# Altium project myAmp.PrjPcb
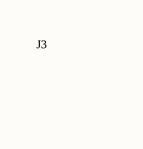
[diagram p0: myAmp.SchDoc, top left]
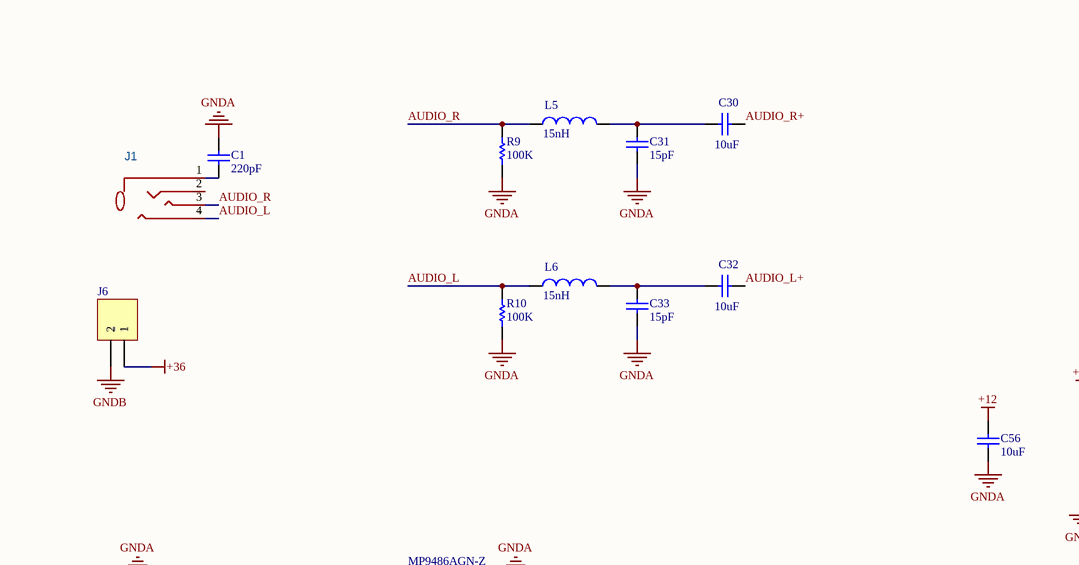
[diagram p1: myAmp.SchDoc, top middle]
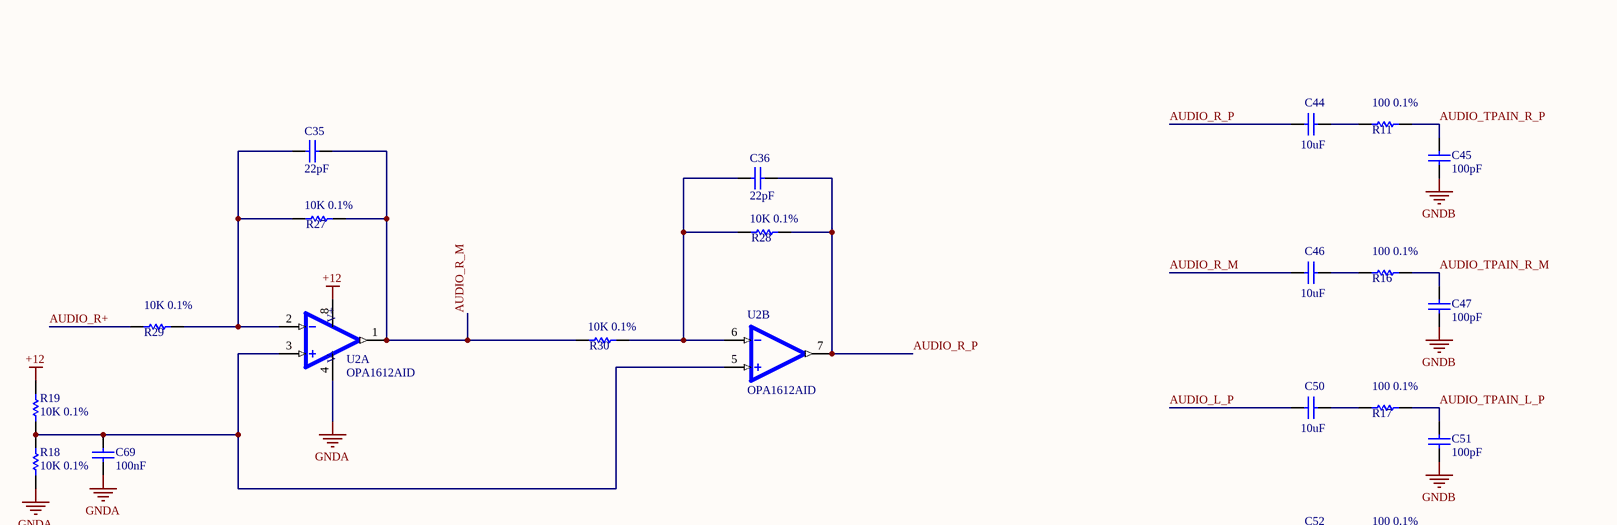
[diagram p2: myAmp.SchDoc, top right]
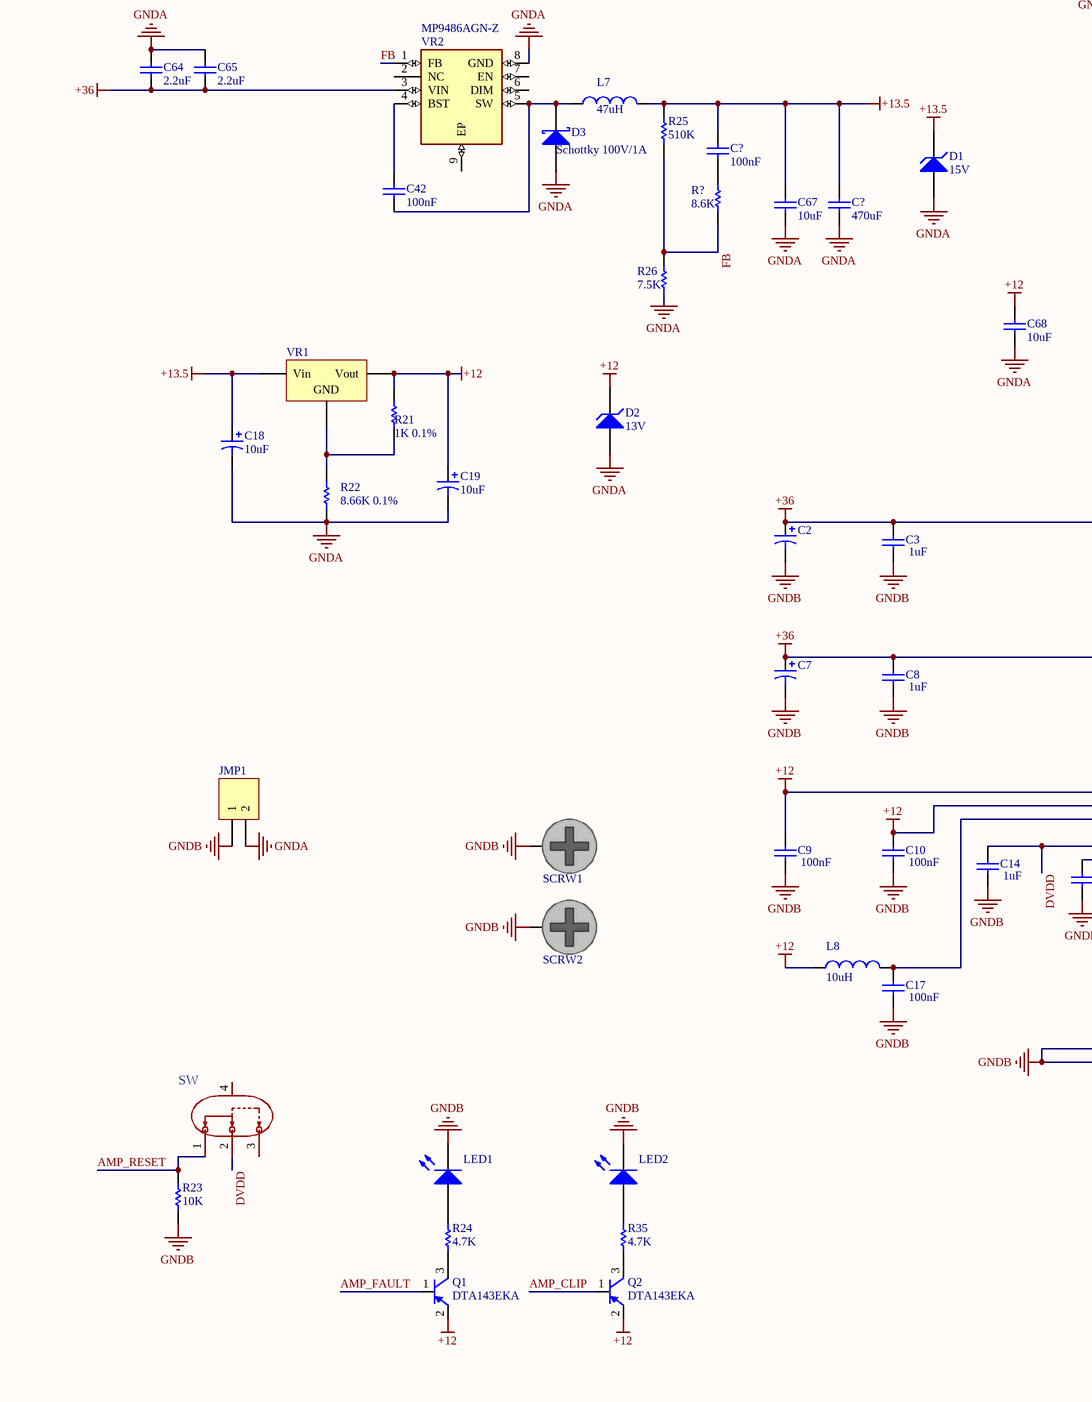
[diagram p3: myAmp.SchDoc, bottom middle]
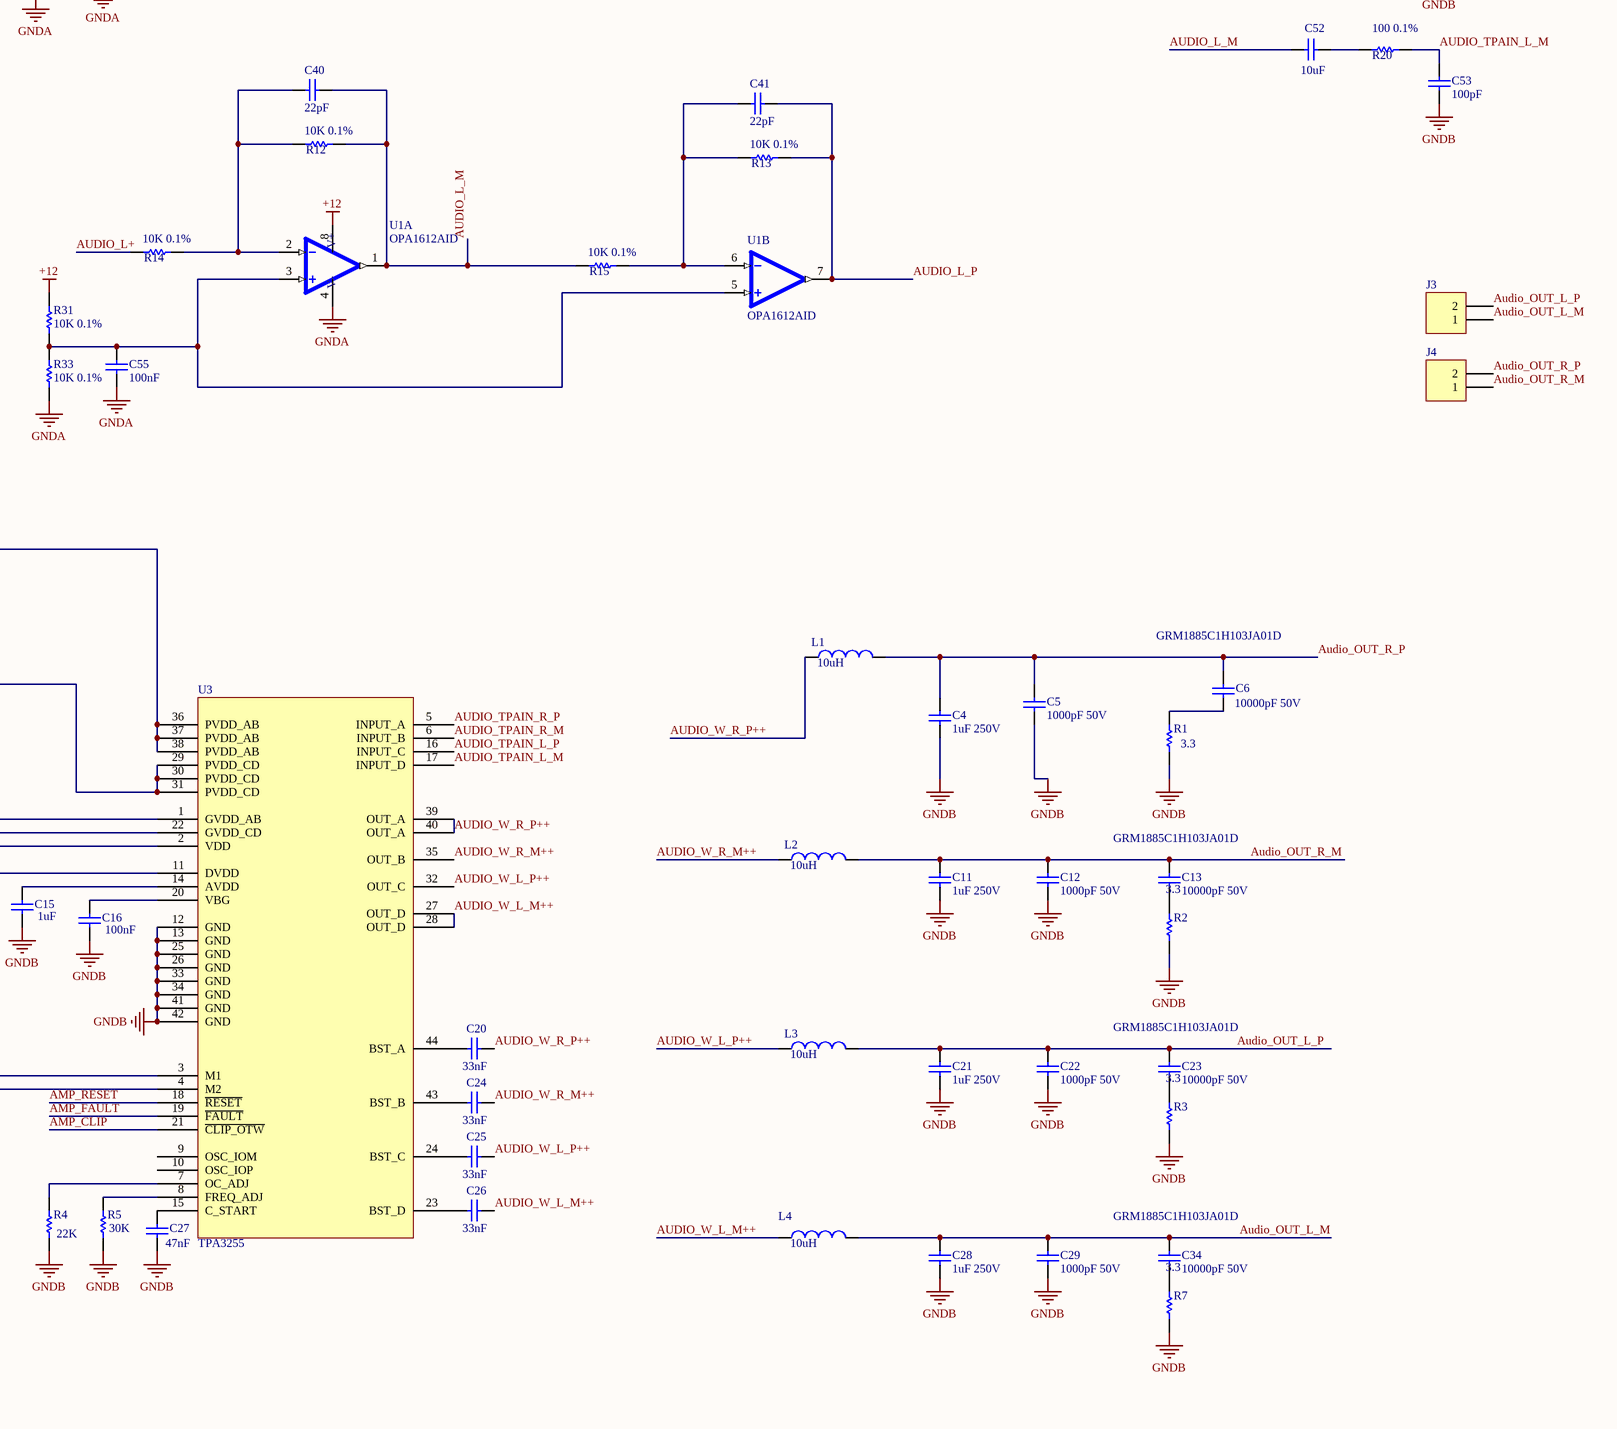
[diagram p4: myAmp.SchDoc, bottom right]
1 sheet, 116 parts. Net scope: global (net labels, ports and power ports of the same name join across sheets).
Board file: myAMP.PcbDoc

## Sheet myAmp.SchDoc
size C; SheetNumber: 1; SheetTotal: 1; SPICEModelCacheTZAFCKPT: <root> / <DocumentId>TZAFCKPT</DocumentId> / <CacheFrame Number="0"> / <Model Name="res" Kind="MDL"> / <Text>*Default semiconductor resistor / .MODEL RES R()</Text> / </Model> / <Model Name="skydiode" Kind="MDL"> / <Text>*Default Schottky Diode / *Schottky Diode Pinout: A,K / .MODEL SKYDIODE D(EG=0.69 XTI=2)</Text> / </Model> / </CacheFrame> / </root>

### Parts
(Parts that share a designator on the sheet are numbered #1, #2 ... from top to bottom, then left to right.)
C1  220pF  [C_0603_2]
C2  (no value)  [C_16X40]
C3  1uF  [C_0603_2]
C4  value 1uF 250V  [C_MKP_THT]
C5  value 1000pF 50V  [C_0603_2]
C6  GRM1885C1H103JA01D  value 10000pF 50V  [C_0603_2]
C7  a  [C_16X40]  (value not drawn)
C8  1uF  [C_0603_2]
C9  100nF  [C_0603_2]
C10  100nF  [C_0603_2]
C11  value 1uF 250V  [C_MKP_THT]  (hidden comment: PHE426HD7100JR06L2)
C12  value 1000pF 50V  [C_0603_2]
C13  GRM1885C1H103JA01D  value 10000pF 50V  [C_0603_2]
C14  1uF  [C_0603_2]
C15  1uF  [C_0603_2]
C16  100nF  [C_0603_2]
C17  100nF  [C_0603_2]
C18  10uF  [C_EL_5]
C19  10uF  [C_EL_5]
C20  33nF  [C_0603_2]
C21  value 1uF 250V  [C_MKP_THT]  (hidden comment: PHE426HD7100JR06L2)
C22  value 1000pF 50V  [C_0603_2]
C23  GRM1885C1H103JA01D  value 10000pF 50V  [C_0603_2]
C24  33nF  [C_0603_2]
C25  33nF  [C_0603_2]
C26  33nF  [C_0603_2]
C27  47nF  [C_0603_2]
C28  value 1uF 250V  [C_MKP_THT]  (hidden comment: PHE426HD7100JR06L2)
C29  value 1000pF 50V  [C_0603_2]
C30  10uF  [C_5X11]
C31  15pF  [C_0603_2]
C32  10uF  [C_5X11]
C33  15pF  [C_0603_2]
C34  GRM1885C1H103JA01D  value 10000pF 50V  [C_0603_2]
C35  22pF  [C_0603_2]
C36  22pF  [C_0603_2]
C40  22pF  [C_0603_2]
C41  22pF  [C_0603_2]
C42  value 100nF  [C_0603_2]  (hidden comment: Cap)
C44  10uF  [C_5X11]
C45  100pF  [C_0603_2]
C46  10uF  [C_5X11]
C47  100pF  [C_0603_2]
C50  10uF  [C_5X11]
C51  100pF  [C_0603_2]
C52  10uF  [C_5X11]
C53  100pF  [C_0603_2]
C55  value 100nF  [C_0603_2]  (hidden comment: Cap)
C56  10uF  [C_0603_2]
C64  value 2.2uF  [C_0603_2]  (hidden comment: Cap)
C65  value 2.2uF  [C_0603_2]  (hidden comment: Cap)
C67  10uF  [C_5X11]
C68  10uF  [C_0603_2]
C69  value 100nF  [C_0603_2]  (hidden comment: Cap)
C?#1  100nF  [C_0603_2]
C?#2  470uF  [C_10X12]
D1  15V  [D_SOD123]
D2  13V  [DO-214AC]
D3  Schottky 100V/1A  [DO-214AC]
J1  PJ-321B  [J_PJ-321B]  (value not drawn)
J3  VH3P2  [VH3_2]  (value not drawn)
J4  VH3P2  [VH3_2]  (value not drawn)
J6  VH3P2  [VH3_2]  (value not drawn)
JMP1  (no value)  [JUMPER_0603]  (no BOM)
L1  value 10uH  [L_SLF12565]  (hidden comment: MA5172)
L2  value 10uH  [L_SLF12565]  (hidden comment: MA5172)
L3  value 10uH  [L_SLF12565]  (hidden comment: MA5172)
L4  value 10uH  [L_SLF12565]  (hidden comment: MA5172)
L5  15nH  [L_0805]
L6  15nH  [L_0805]
L7  value 47uH  [L_SLF12565]  (hidden comment: Inductor)
L8  10uH  [L_0603_2]
LED1  LED RED  [LED_1206_RED]  (value not drawn)
LED2  LED RED  [LED_1206_RED]  (value not drawn)
Q1  DTA143EKA  [TRANS_DTC113ZKAT146]
Q2  DTA143EKA  [TRANS_DTC113ZKAT146]
R1  3.3  [R_1206]
R2  3.3  [R_1206]
R3  3.3  [R_1206]
R4  22K  [R_0603_2]
R5  30K  [R_0603_2]
R7  3.3  [R_1206]
R9  100K  [R_0603_2]
R10  100K  [R_0603_2]
R11  100 0.1%  [R_0805]
R12  10K 0.1%  [R_0805]
R13  10K 0.1%  [R_0805]
R14  10K 0.1%  [R_0805]
R15  10K 0.1%  [R_0805]
R16  100 0.1%  [R_0805]
R17  100 0.1%  [R_0805]
R18  value 10K 0.1%  [R_0603_2]  (hidden comment: Res Semi)
R19  value 10K 0.1%  [R_0603_2]  (hidden comment: Res Semi)
R20  100 0.1%  [R_0805]
R21  value 1K 0.1%  [R_0805]  (hidden comment: Res1)
R22  value 8.66K 0.1%  [R_1206]  (hidden comment: Res1)
R23  10K  [R_0603_2]
R24  4.7K  [R_0805]
R25  value 510K  [R_0603_2]  (hidden comment: Res1)
R26  value 7.5K  [R_0603_2]  (hidden comment: Res1)
R27  10K 0.1%  [R_0805]
R28  10K 0.1%  [R_0805]
R29  10K 0.1%  [R_0805]
R30  10K 0.1%  [R_0805]
R31  value 10K 0.1%  [R_0603_2]  (hidden comment: Res Semi)
R33  value 10K 0.1%  [R_0603_2]  (hidden comment: Res Semi)
R35  4.7K  [R_0805]
R?  value 8.6K  [R_0603_2]  (hidden comment: Res1)
SCRW1  SCREW  [HOLE_3M]  (value not drawn)
SCRW2  SCREW  [HOLE_3M]  (value not drawn)
SW  MSS12C02LS-BB2.0  [PCBComponent_1]  (value not drawn)
U1  OPA1612AID  [SO8_2]  (parts A,B of 2)
U2  OPA1612AID  [SO8_2]  (parts A,B of 2)
U3  TPA3255  [HTSSOP44_T]
VR1  Volt Reg  [D2PAK]  (value not drawn)
VR2  MP9486AGN-Z  [SOIC127P600X170-9N]

### Nets
+12: C9.1 C10.1 C19.1 C56.1 C68.1 D2.2(K) L8.1 Q1.2(E) Q2.2(E) R19.2 R21.2 R31.2 U1.8(V+) U2.8(V+) U3.1(GVDD_AB) U3.22(GVDD_CD) VR1.3(Vout)
+13.5: C18.1 C67.1 C?#1.2 C?#2.1 D1.2(K) L7.2 R25.2 VR1.1(Vin)
+36: C2.1 C3.1 C7.1 C8.1 C64.1 C65.1 J6.1 U3.29(PVDD_CD) U3.30(PVDD_CD) U3.31(PVDD_CD) U3.36(PVDD_AB) U3.37(PVDD_AB) U3.38(PVDD_AB) VR2.3(VIN)
GNDA: C1.1 C18.2 C19.2 C31.1 C33.1 C55.2 C56.2 C64.2 C65.2 C67.2 C68.2 C69.2 C?#2.2 D1.1(A) D2.1(A) D3.1(A) JMP1.2 R9.1 R10.1 R18.1 R22.1 R26.1 R33.1 U1.4(V-) U2.4(V-) VR2.8(GND)
GNDB: C2.2 C3.2 C4.2 C5.2 C7.2 C8.2 C9.2 C10.2 C11.2 C12.2 C14.2 C15.2 C16.2 C17.2 C21.2 C22.2 C27.2 C28.2 C29.2 C45.2 C47.2 C51.2 C53.2 J6.2 JMP1.1 LED1.2(K) LED2.2(K) R1.1 R2.1 R3.1 R4.1 R5.1 R7.1 R23.2 SCRW1.1 SCRW2.1 U3.3(M1) U3.4(M2) U3.12(GND) U3.13(GND) U3.25(GND) U3.26(GND) U3.33(GND) U3.34(GND) U3.41(GND) U3.42(GND)
AMP_CLIP: Q2.1(B) U3.21(~{CLIP_OTW})
AMP_FAULT: Q1.1(B) U3.19(~{FAULT})
AMP_RESET: R23.1 SW.1 U3.18(~{RESET})
AUDIO_L: J1.4 L6.1 R10.2
AUDIO_L+: C32.2 R14.1
AUDIO_L_M: C40.1 C52.1 R12.2 R15.1 U1.1(OUTA)
AUDIO_L_P: C41.1 C50.1 R13.2 U1.7(OUTB)
Audio_OUT_L_M: C28.1 C29.1 C34.1 J3.1 L4.2
Audio_OUT_L_P: C21.1 C22.1 C23.1 J3.2 L3.2
Audio_OUT_R_M: C11.1 C12.1 C13.1 J4.1 L2.2
Audio_OUT_R_P: C4.1 C5.1 C6.1 J4.2 L1.2
AUDIO_R: J1.3 L5.1 R9.2
AUDIO_R+: C30.2 R29.1
AUDIO_R_M: C35.1 C46.1 R27.2 R30.1 U2.1(OUTA)
AUDIO_R_P: C36.1 C44.1 R28.2 U2.7(OUTB)
AUDIO_TPAIN_L_M: C53.1 R20.2 U3.17(INPUT_D)
AUDIO_TPAIN_L_P: C51.1 R17.2 U3.16(INPUT_C)
AUDIO_TPAIN_R_M: C47.1 R16.2 U3.6(INPUT_B)
AUDIO_TPAIN_R_P: C45.1 R11.2 U3.5(INPUT_A)
AUDIO_W_L_M++: C26.1 L4.1 U3.27(OUT_D) U3.28(OUT_D)
AUDIO_W_L_P++: C25.1 L3.1 U3.32(OUT_C)
AUDIO_W_R_M++: C24.1 L2.1 U3.35(OUT_B)
AUDIO_W_R_P++: C20.1 L1.1 U3.39(OUT_A) U3.40(OUT_A)
DVDD: C14.1 SW.2 U3.11(DVDD)
FB: R25.1 R26.2 R?.1 VR2.1(FB)
NetC1_2: C1.2 J1.1
NetC6_2: C6.2 R1.2
NetC13_2: C13.2 R2.2
NetC15_1: C15.1 U3.14(AVDD)
NetC16_1: C16.1 U3.20(VBG)
NetC17_1: C17.1 L8.2 U3.2(VDD)
NetC20_2: C20.2 U3.44(BST_A)
NetC23_2: C23.2 R3.2
NetC24_2: C24.2 U3.43(BST_B)
NetC25_2: C25.2 U3.24(BST_C)
NetC26_2: C26.2 U3.23(BST_D)
NetC27_1: C27.1 U3.15(C_START)
NetC30_1: C30.1 C31.2 L5.2
NetC32_1: C32.1 C33.2 L6.2
NetC34_2: C34.2 R7.2
NetC35_2: C35.2 R27.1 R29.2 U2.2(-INA)
NetC36_2: C36.2 R28.1 R30.2 U2.6(-INB)
NetC40_2: C40.2 R12.1 R14.2 U1.2(-INA)
NetC41_2: C41.2 R13.1 R15.2 U1.6(-INB)
NetC42_1: C42.1 VR2.4(BST)
NetC42_2: C42.2 D3.2(K) L7.1 VR2.5(SW)
NetC44_2: C44.2 R11.1
NetC46_2: C46.2 R16.1
NetC50_2: C50.2 R17.1
NetC52_2: C52.2 R20.1
NetC55_1: C55.1 R31.1 R33.2 U1.3(+INA) U1.5(+INB)
NetC69_1: C69.1 R18.2 R19.1 U2.3(+INA) U2.5(+INB)
NetC?#1_1: C?#1.1 R?.2
NetLED1_1: LED1.1(A) R24.1
NetLED2_1: LED2.1(A) R35.1
NetQ1_3: Q1.3(C) R24.2
NetQ2_3: Q2.3(C) R35.2
NetR4_2: R4.2 U3.7(OC_ADJ)
NetR5_2: R5.2 U3.8(FREQ_ADJ)
NetR21_1: R21.1 R22.2 VR1.2(GND)

Not connected (* = marked no-connect by the designer): J1 2; SW 3 4; U3 9(OSC_IOM) 10(OSC_IOP); VR2 2(NC) 6(DIM) 7(EN) 9(EP)

### Notes on the sheet
- J3

### Library data of the parts
C1 C3-C6 C8-C17 C20-C34 C42 C44 C46 C50 C52 C55 C56 C64 C65 C67-C69 = Cap: Capacitor; Published: 8-Jun-2000; LatestRevisionDate: 17-Jul-2002; LatestRevisionNote: Re-released for DXP Platform.; PackageReference: RAD-0.3; Publisher: Altium Limited
  C1: Value: 220pF
  C3 C8 C14 C15: PackageDescription: Radial Cap, Thru-Hole; 2 Leads; 0.3 in Pin Spacing; Value: 1uF
  C4-C6 C11-C13 C21-C23 C28 C29 C34 C42 C55 C64 C65 C69: PackageDescription: Radial Cap, Thru-Hole; 2 Leads; 0.3 in Pin Spacing
  C9 C10 C16 C17: PackageDescription: Radial Cap, Thru-Hole; 2 Leads; 0.3 in Pin Spacing; Value: 100nF
  C20 C24-C26: PackageDescription: Radial Cap, Thru-Hole; 2 Leads; 0.3 in Pin Spacing; Value: 33nF
  C27: PackageDescription: Radial Cap, Thru-Hole; 2 Leads; 0.3 in Pin Spacing; Value: 47nF
  C30 C32 C44 C46 C50 C52 C56 C67 C68: Value: 10uF
  C31 C33: Value: 15pF
C2 C7 = Cap Pol1: Polarized Capacitor (Radial); Value: 2700uF 50V; Published: 8-Jun-2000; LatestRevisionDate: 17-Jul-2002; LatestRevisionNote: Re-released for DXP Platform.; PackageReference: RB7.6-15; Publisher: Altium Limited
C18 C19 = Cap Pol1: Polarized Capacitor (Radial); Value: 470uF 50V; Published: 8-Jun-2000; LatestRevisionDate: 17-Jul-2002; LatestRevisionNote: Re-released for DXP Platform.; PackageReference: RB7.6-15; Publisher: Altium Limited
C35 C36 C40 C41 = Cap: Capacitor; Value: 15pF; Published: 8-Jun-2000; LatestRevisionDate: 17-Jul-2002; LatestRevisionNote: Re-released for DXP Platform.; PackageReference: RAD-0.3; Publisher: Altium Limited
C45 C47 C51 C53 C?#1 C?#2 = Cap: Capacitor; Value: 10uF; Published: 8-Jun-2000; LatestRevisionDate: 17-Jul-2002; LatestRevisionNote: Re-released for DXP Platform.; PackageReference: RAD-0.3; Publisher: Altium Limited
D1 D2 = D Zener: Zener Diode; Published: 8-Jun-2000; LatestRevisionDate: 17-Jul-2002; LatestRevisionNote: Re-released for DXP Platform.; PackageReference: DIODE-0.7; Publisher: Altium Limited; PackageDescription: Diode, Thru-Hole; 2 Leads; 0.7 in Pin Spacing
D3 = D Schottky: Schottky Diode; Published: 8-Jun-2000; LatestRevisionDate: 17-Jul-2002; LatestRevisionNote: Re-released for DXP Platform.; PackageReference: SMB; Publisher: Altium Limited; PackageDescription: DO-214-AA/SMB; 2 C-Bend Leads; Body 5.3 x 3.6 mm, inc. leads (LxW); Code_JEDEC: DO-214-AA
J1 = PJ-321B: Manufacturer: XKB Connection(中国星坤); Add into BOM: yes; Connector Type: 3.5mm耳机座; Current Rating (Max): 500mA; Voltage Rating (Max): 30V; Soldering Temperature(Max): 235℃; Symbol: PJ-321B; Device: PJ-321B; LCSC Part Name: 3.5mm耳机座; Supplier Part: C692436; Manufacturer Part: PJ-321B; Supplier Footprint: 插件; JLCPCB Part Class: Extended Part; Datasheet: https://atta.szlcsc.com/upload/public/pdf/source/20211011/0B12C1EC3FF575692CC2E8C172D7F9F9.pdf; Supplier: LCSC; Convert to PCB: yes; Operating Temperature Range: -20℃~+70℃
J3 J4 J6 JMP1 = Header 2: Header, 2-Pin; LatestRevisionDate: 17-Jul-2002; LatestRevisionNote: Re-released for DXP Platform.; Publisher: Altium Limited
L1-L8 = Inductor: Code_IEC: 1005; Published: 8-Jun-2000; LatestRevisionDate: 29-May-2009; LatestRevisionNote: IPC-7351 Footprint Added.; PackageReference: 0402-A; Publisher: Altium Limited; PackageDescription: Chip Inductor; Code_JEITA: 0402
  L5 L6: Value: 15nH
  L8: Value: 10uH
LED1 LED2 = LED0: Published: 8-Jun-2000; LatestRevisionDate: 08-Jul-2005; LatestRevisionNote: Mech Layer 1 removed.; PackageReference: LED-0; Publisher: Altium Limited
Q1 Q2 = PNP_MMBT2907_SOT23: BJT, PNP, 40v, 0.6A, SMD, SOT23; pin to pad: 1>2 2>1; PARAM2: 250mW; MANF: Diodes, NXP, FAIRCHILD, ON; PARAM: 40v, 0.6A; MANF_P#: MMBT2907
R1-R5 R7 R21 R22 R25 R26 R? = Res1: Resistor; Published: 8-Jun-2000; LatestRevisionDate: 17-Jul-2002; LatestRevisionNote: Re-released for DXP Platform.; PackageReference: AXIAL-0.3; Publisher: Altium Limited; PackageDescription: Axial Device, Thru-Hole; 2 Leads; 0.3 in Pin Spacing
  R1-R3 R7: Value: 3.3
  R4: Value: 22K
  R5: Value: 30K
R9 R10 = Res SEMI: Semiconductor Resistor; Published: 8-Jun-2000; LatestRevisionDate: 17-Jul-2002; LatestRevisionNote: Re-released for DXP Platform.; PackageReference: AXIAL-0.5; Publisher: Altium Limited; Value: 100K; Parameter 1: *
R11-R17 R20 R27-R30 = Res SEMI: Semiconductor Resistor; Value: 100; Published: 8-Jun-2000; LatestRevisionDate: 17-Jul-2002; LatestRevisionNote: Re-released for DXP Platform.; PackageReference: AXIAL-0.5; Publisher: Altium Limited; Parameter 1: *
R18 R19 R31 R33 = Res Semi: Semiconductor Resistor; Published: 8-Jun-2000; LatestRevisionDate: 17-Jul-2002; LatestRevisionNote: Re-released for DXP Platform.; PackageReference: AXIAL-0.5; Publisher: Altium Limited; PackageDescription: Axial Device, Thru-Hole; 2 Leads; 0.5 in Pin Spacing
R23 R24 R35 = Res1: Resistor; Value: 22K; Published: 8-Jun-2000; LatestRevisionDate: 17-Jul-2002; LatestRevisionNote: Re-released for DXP Platform.; PackageReference: AXIAL-0.3; Publisher: Altium Limited; PackageDescription: Axial Device, Thru-Hole; 2 Leads; 0.3 in Pin Spacing
SCRW1 SCRW2 = SCRW: SCREW, M4, 4mm diameter and 8.0mm, FlatHead; ASSEMBLY: DNP; VALUE: SCREW
SW = MSS12C02LS-BB2.0: Manufacturer: SHOU HAN(首韩); Add into BOM: yes; Circuit: SPDT; Pin Style: SMDSplicing; Switch Length: 6.65mm; Switch Width: 2.75mm; Switch Height: 1.4mm; Current Rating (DC): 100mA; Voltage Rating (DC): 12V; Mechanical Life: 1万次; Symbol: MSS12C02LS-BB2.0; Device: MSS12C02LS-BB2.0; LCSC Part Name: MSS12C02LS-BB2.0; Supplier Part: C3008585; Manufacturer Part: MSS12C02LS-BB2.0; Supplier Footprint: SMD; JLCPCB Part Class: Extended Part; Datasheet: https://atta.szlcsc.com/upload/public/pdf/source/20220429/8AEFBC67104491914BC5659DE1F359A3.pdf; Supplier: LCSC; Convert to PCB: yes; Actuator Style: -; Mounting Style: Brick nogging; Actuator Color: -; Current Rating (AC): -; Voltage Rating (AC): -; Operating Temperature: -25℃~+70℃
U1 U2 = OPA1612AID: SoundPlus Audio Operational Amplifier with 1.1nV/?Hz Noise, Low THD and Precision 8-SOIC -40 to 85; MF: Texas Instruments; Purchase-URL: https://pricing.snapeda.com/search/part/OPA1612AID/?ref=eda; MP: OPA1612AID; Package: SOIC-8 Texas Instruments; Price: None; Availability: In Stock; SnapEDA_Link: https://www.snapeda.com/parts/OPA1612AID/Texas+Instruments/view-part/?ref=snap; Value: *; Check_prices: https://www.snapeda.com/parts/OPA1612AID/Texas+Instruments/view-part/?ref=eda
VR1 = Volt Reg: Voltage Regulator; Published: 24-Mar-1999; LatestRevisionDate: 29-May-2009; LatestRevisionNote: IPC-7351 Footprint Added.; PackageReference: D2PAK; Publisher: Altium Limited; PackageDescription: 3-Pin Transistor Outline Package 2.54 mm Pitch, 15.1 mm Lead Span
VR2 = MP9486AGN-Z: Buck Switching Regulator IC Positive Fixed 5V 1 Output 1A 8-SOIC (0.154, 3.90mm Width) Exposed Pad; MF: Monolithic Power; SnapEDA_Link: https://www.snapeda.com/parts/MP9486AGN-Z/Monolithic+Power+Systems+Inc./view-part/?ref=snap; Package: SOIC-8 Monolithic Power; Value: *; MP: MP9486AGN-Z; Check_prices: https://www.snapeda.com/parts/MP9486AGN-Z/Monolithic+Power+Systems+Inc./view-part/?ref=eda